# Altium schematic sheet RF.SchDoc
size A
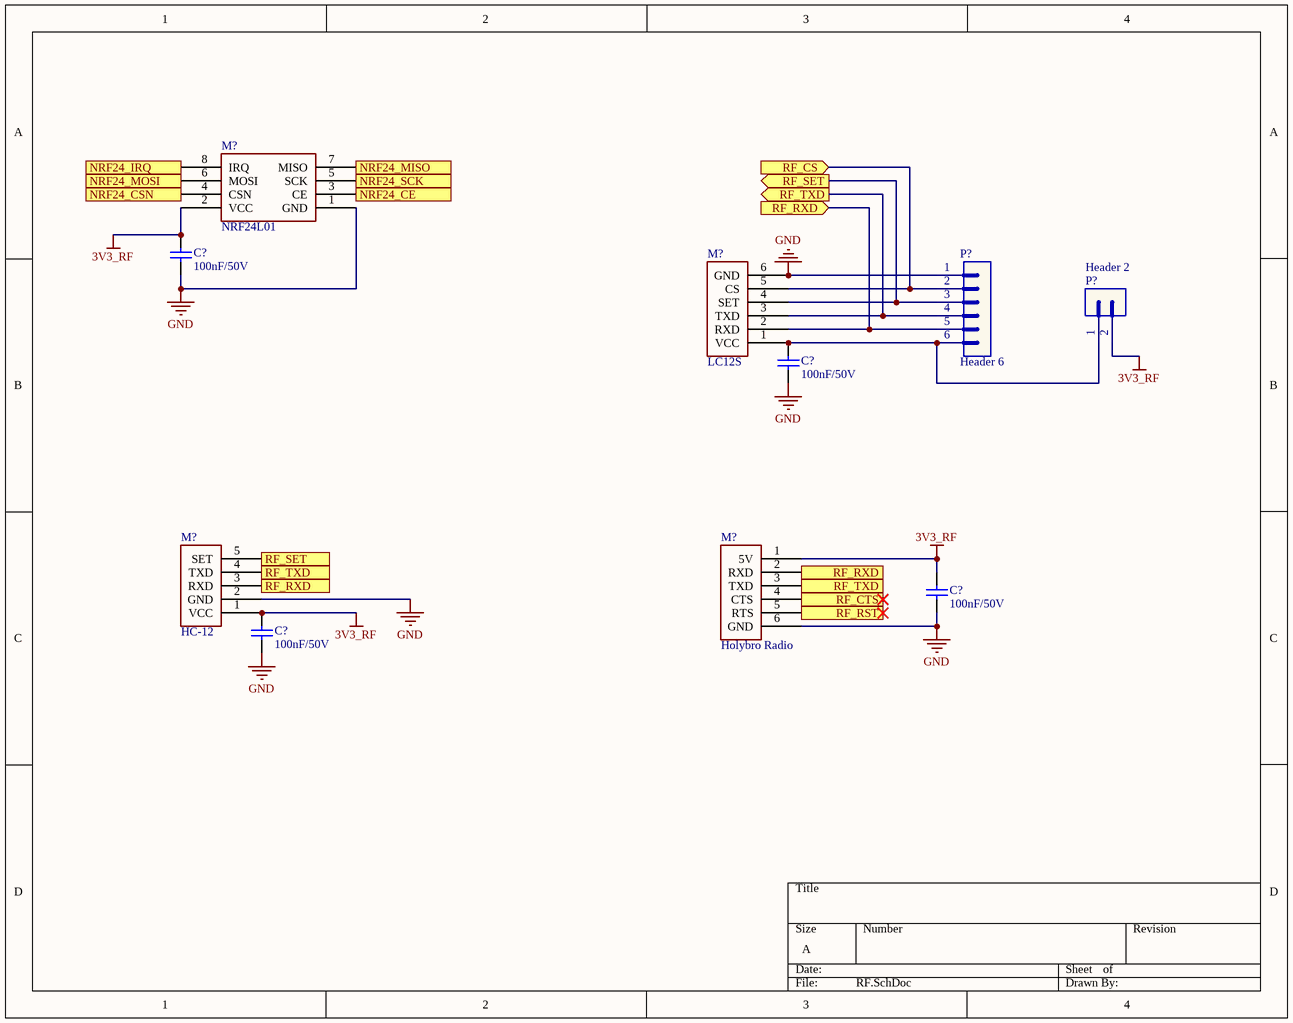
[diagram p0: RF.SchDoc]

## Parts
(Parts that share a designator on the sheet are numbered #1, #2 ... from top to bottom, then left to right.)
C?#1  value 100nF/50V  [CAP-SM-0805]  (hidden comment: Cap-100nF-50V-0805)
C?#2  value 100nF/50V  [CAP-SM-0805]  (hidden comment: Cap-100nF-50V-0805)
C?#3  value 100nF/50V  [CAP-SM-0805]  (hidden comment: Cap-100nF-50V-0805)
C?#4  value 100nF/50V  [CAP-SM-0805]  (hidden comment: Cap-100nF-50V-0805)
M?#1  NRF24L01  [NRF24L01]
M?#2  LC12S  [LC12S]
M?#3  HC-12  [HC-12]
M?#4  Holybro Radio  [Holybro-Radio]
P?#1  Header 6  [JP6]
P?#2  Header 2  [JP2]

## Ports
NRF24_CE (in), NRF24_CSN (in), NRF24_IRQ (out), NRF24_MISO (out), NRF24_MOSI (in), NRF24_SCK (in), RF_CS (in), RF_CTS (in), RF_RST (out), RF_RXD (in), RF_RXD (out), RF_SET (out), RF_TXD (in), RF_TXD (out)

## Nets
3V3_RF: C?#1.2 C?#3.2 C?#4.2 M?#1.2(VCC) M?#3.1(VCC) M?#4.1(5V) P?#2.2
GND: C?#1.1 C?#2.1 C?#3.1 C?#4.1 M?#1.1(GND) M?#2.6(GND) M?#3.2(GND) M?#4.6(GND) P?#1.1
NRF24_CE: M?#1.3(CE) ; port NRF24_CE
NRF24_CSN: M?#1.4(CSN) ; port NRF24_CSN
NRF24_IRQ: M?#1.8(IRQ) ; port NRF24_IRQ
NRF24_MISO: M?#1.7(MISO) ; port NRF24_MISO
NRF24_MOSI: M?#1.6(MOSI) ; port NRF24_MOSI
NRF24_SCK: M?#1.5(SCK) ; port NRF24_SCK
RF_CS: M?#2.5(CS) P?#1.2 ; port RF_CS
RF_CTS: M?#4.4(CTS) ; port RF_CTS
RF_RST: M?#4.5(RTS) ; port RF_RST
RF_RXD: M?#2.2(RXD) M?#3.3(RXD) M?#4.2(RXD) P?#1.5 ; port RF_RXD
RF_SET: M?#2.4(SET) M?#3.5(SET) P?#1.3 ; port RF_SET
RF_TXD: M?#2.3(TXD) M?#3.4(TXD) M?#4.3(TXD) P?#1.4 ; port RF_TXD
NetC?#2_2: C?#2.2 M?#2.1(VCC) P?#1.6 P?#2.1

## Library data of the parts
C?#1-C?#4 = Cap-100nF-50V-0805: CAP CER 0.1UF 50V Y5V 0805; Manufacturer: Samsung Electro-Mechanics; Manufacturer Part Number: CL21F104ZBCNNNC; Local Supplier: thegioiic; Local Supplier Link: https://thegioiic.com/products/tu-100nf-0-1uf-50v-0805; Supplier 1: Digikey; Supplier 1 Part Number: 1276-1007-1-ND; Supplier 1 Link: https://www.digikey.com/product-detail/en/samsung-electro-mechanics/CL21F104ZBCNNNC/1276-1007-1-ND/3889093
P?#1 = Header 6: Header, 6-Pin; LatestRevisionDate: 17-Jul-2002; LatestRevisionNote: Re-released for DXP Platform.; Publisher: Altium Limited
P?#2 = Header 2: Header, 2-Pin; LatestRevisionDate: 17-Jul-2002; LatestRevisionNote: Re-released for DXP Platform.; Publisher: Altium Limited
M?#1 = NRF24L01: Local Supplier Link: https://hshop.vn/products/mach-thu-phat-nrf24l01-pa-2-4ghzcu-khech-dai-cung-suat-thu-phat; Local Supplier: HShop; Local Supplier Part Number: HS000888; Manufacturer: *; Manufacturer Part Number: *
M?#2 = LC12S: Local Supplier Link: https://hshop.vn/products/mach-thu-phat-rf-uart-lc12s-2-4ghz?fbclid=IwAR3h1hU0io-Cc4GBL9Q-KMB_-TKtvE-b63OAEmRNHthVrXHliy_JpDId3Yg; Local Supplier: HShop; Local Supplier Part Number: HS00095; Manufacturer: *; Manufacturer Part Number: *
M?#3 = HC-12: Local Supplier: HShop; Local Supplier Link: https://hshop.vn/products/mach-thu-phat-rf-uart-si4463-433mhzkhoang-coch-1km; Local Supplier Part Number: HS000897; Manufacturer: *; Manufacturer Part Number: *
M?#4 = Holybro Radio: Local Supplier: *; Local Supplier Link: https://www.lazada.vn/products/ld-holybro-433mhz-915-mhz-500-mw-thu-phat-vo-tuyen-xa-bo-v3-cho-pixhawk-4-dieu-khien-chuyen-bay-i430804435-s768474304.html?spm=a2o4n.searchlist.list.4.25396b19yIS9XO&search=1; Local Supplier Part Number: *; Manufacturer: *; Manufacturer Part Number: *